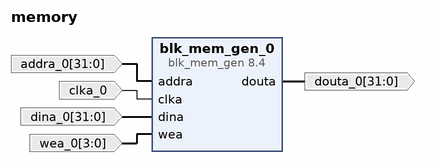
[diagram p0: block diagram of the top level]
# Vivado block design memory, xc7a15tcpg236-1, Vivado 2023.2
create_bd_design memory

create_bd_port -dir O -from 31 -to 0 douta_0
create_bd_port -dir I -from 3 -to 0 wea_0
create_bd_port -dir I -type clk clka_0
create_bd_port -dir I -from 31 -to 0 dina_0
create_bd_port -dir I -from 31 -to 0 addra_0

create_bd_cell -type ip -vlnv xilinx.com:ip:blk_mem_gen:8.4 blk_mem_gen_0
set_property -dict [list \
  CONFIG.Coe_File ../../../../../../prog/build/rom.coe \
  CONFIG.Enable_32bit_Address true \
  CONFIG.Enable_A Always_Enabled \
  CONFIG.Fill_Remaining_Memory_Locations true \
  CONFIG.Load_Init_File true \
  CONFIG.Operating_Mode_A READ_FIRST \
  CONFIG.Register_PortA_Output_of_Memory_Primitives false \
  CONFIG.Use_RSTA_Pin false \
  CONFIG.Write_Depth_A 1024 \
  CONFIG.use_bram_block Stand_Alone \
] [get_bd_cells blk_mem_gen_0]

# ---- connections ----

connect_bd_net -net addra_0_1 [get_bd_ports addra_0] [get_bd_pins blk_mem_gen_0/addra]
connect_bd_net [get_bd_pins blk_mem_gen_0/douta] [get_bd_ports douta_0]
connect_bd_net -net clka_0_1 [get_bd_ports clka_0] [get_bd_pins blk_mem_gen_0/clka]
connect_bd_net -net dina_0_1 [get_bd_ports dina_0] [get_bd_pins blk_mem_gen_0/dina]
connect_bd_net -net wea_0_1 [get_bd_ports wea_0] [get_bd_pins blk_mem_gen_0/wea]

validate_bd_design
save_bd_design
